# Altium project isolated TTL_to_485.PrjPcb
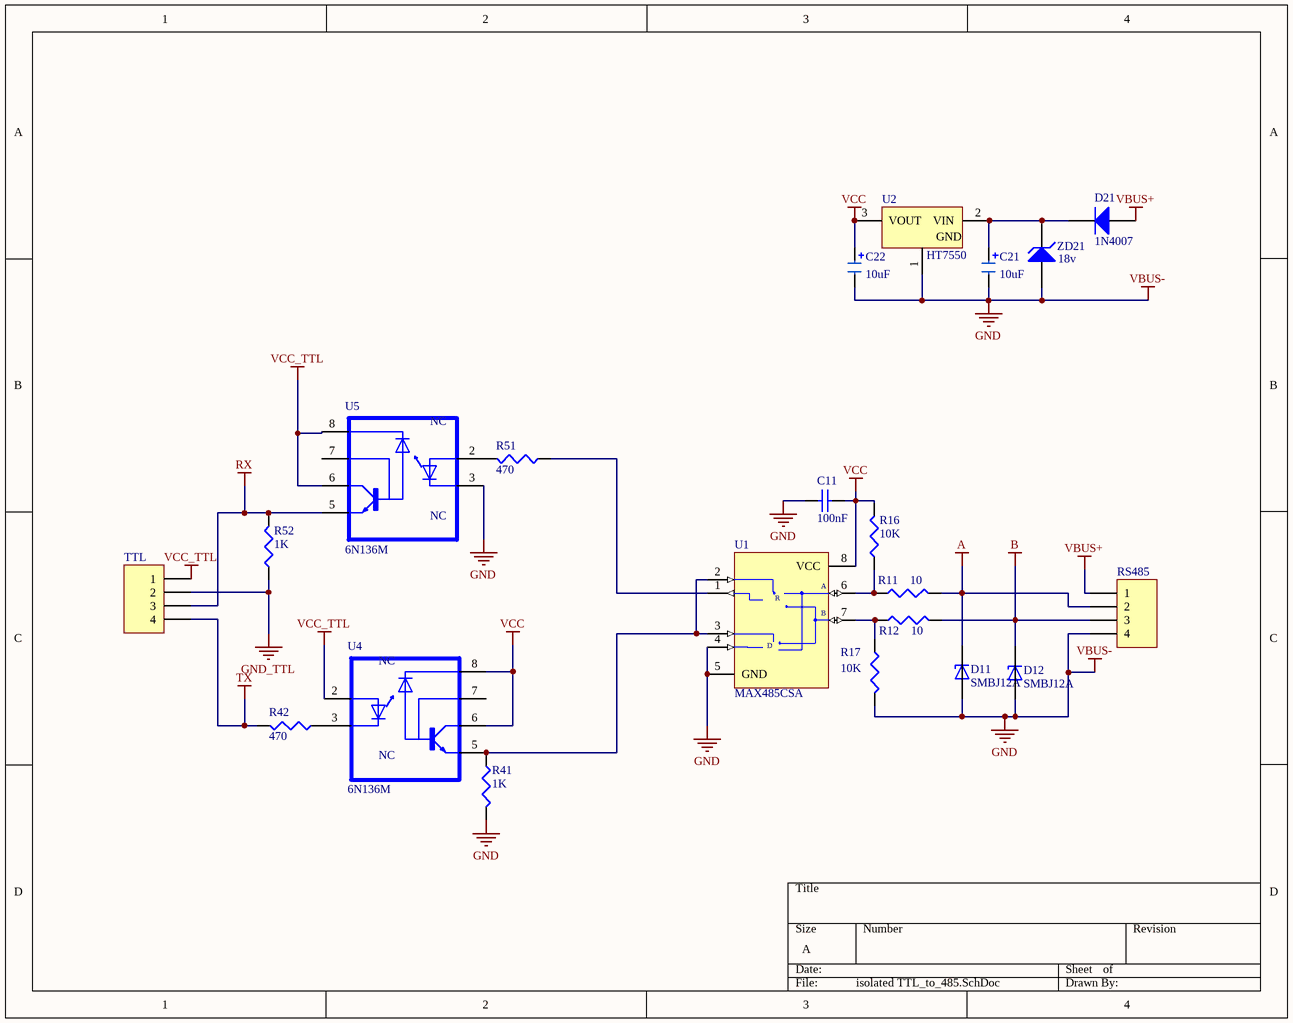
[diagram p0: isolated TTL_to_485.SchDoc]
1 sheet, 21 parts. Net scope: global (net labels, ports and power ports of the same name join across sheets).
Board file: isolated TTL_to_485.PcbDoc

## Sheet isolated TTL_to_485.SchDoc
size A

### Parts
C11  value 100nF  [C1206]  (hidden comment: Cap)
C21  value 10uF  [Tantalium CASE B]  (hidden comment: 106E)
C22  value 10uF  [Tantalium CASE B]  (hidden comment: 106C)
D11  SMBJ12A  [DIOM4336X265N]
D12  SMBJ12A  [DIOM4336X265N]
D21  1N4007  [SMA]
R11  value 10  [1206 Resistor]  (hidden comment: Res)
R12  value 10  [1206 Resistor]  (hidden comment: Res)
R16  value 10K  [1206 Resistor]  (hidden comment: Res)
R17  value 10K  [1206 Resistor]  (hidden comment: Res)
R41  value 1K  [1206 Resistor]  (hidden comment: Res)
R42  value 470  [1206 Resistor]  (hidden comment: Res)
R51  value 470  [1206 Resistor]  (hidden comment: Res)
R52  value 1K  [1206 Resistor]  (hidden comment: Res)
RS485  Header 4  [HDR1X4]  (value not drawn)
TTL  Header 4  [HDR1X4]  (value not drawn)
U1  MAX485CSA  [NSO8_N]
U2  HT7550  [SOT-89_M]
U4  6N136M  [DIP762W50P254L977H451Q8]
U5  6N136M  [DIP762W50P254L977H451Q8]
ZD21  value 18v  [Mini MELF]  (hidden comment: Diode Zener)

### Nets
A: D11.C R11.2 RS485.2
B: D12.C R12.2 RS485.3
GND: C11.2 C21.2 C22.2 D11.A D12.A R17.2 R41.2 RS485.4 U1.4(DI) U1.5(GND) U2.1(GND) U5.3(C) ZD21.1(A)  [also labelled VBUS-]
GND_TTL: R52.1 TTL.2
RX: R52.2 TTL.3 U5.5(E/GND)
TX: R42.2 TTL.4
VBUS+: D21.1(A) RS485.1
VCC: C11.1 C22.1 R16.2 U1.8(VCC) U2.3(VOUT) U4.6(C/VO) U4.8(C/VCC)
VCC_TTL: TTL.1 U4.2(A) U5.6(C/VO) U5.8(C/VCC)
NetC21_1: C21.1 D21.2(K) U2.2(VIN) ZD21.2(K)
NetR11_1: R11.1 R16.1 U1.6(A)
NetR12_1: R12.1 R17.1 U1.7(B)
NetR41_1: R41.1 U1.2(~{RE}) U1.3(DE) U4.5(E/GND)
NetR42_1: R42.1 U4.3(C)
NetR51_1: R51.1 U1.1(RO)
NetR51_2: R51.2 U5.2(A)

Not connected (* = marked no-connect by the designer): U4 7(B/VB); U5 7(B/VB)

### Notes on the sheet
- (in symbol 6N136M) NC
- (in symbol MAX485CSA) R; D

### Library data of the parts
C11 = Cap: Capacitor
C21 C22 = Cap Pol2: Polarized Capacitor Tantalium
D11 D12 = SMBJ12A: 15.6V Clamp 17.5A Ipp Tvs Diode Surface Mount DO-214AA (SMB); MF: ON Semiconductor; Purchase-URL: https://pricing.snapeda.com/search/part/SMBJ12A/?ref=eda; MP: SMBJ12A; SnapEDA_Link: https://www.snapeda.com/parts/SMBJ12A/Onsemi/view-part/?ref=snap; Price: None; Package: SMB-2 Fairchild Semiconductor; Check_prices: https://www.snapeda.com/parts/SMBJ12A/Onsemi/view-part/?ref=eda; Value: *; Availability: In Stock
D21 = Diode: Default Diode; Published: 8-Jun-2000; LatestRevisionDate: 17-Jul-2002; LatestRevisionNote: Re-released for DXP Platform.; PackageVersion: Sep-1996; PackageReference: SMC; Publisher: Altium Limited; PackageDescription: DO-214-AB/SMC; 2 C-Bend Leads; Body 7.9 x 5.9 mm, inc. leads (LxW); Code_JEDEC: DO-214-AB
R11 R12 R16 R17 R41 R42 R51 R52 = Res: Resistor; PackageDescription: Chip Resistor
RS485 TTL = Header 4: Header, 4-Pin; LatestRevisionDate: 17-Jul-2002; LatestRevisionNote: Re-released for DXP Platform.; Publisher: Altium Limited
U1 = MAX485CSA: Low-Power, Slew-Rate-Limited RS-485/RS-422 Transceiver; Published: 16-Jan-2001; LatestRevisionDate: 13-Apr-2006; LatestRevisionNote: IPC-7351 Footprint Added.; DatasheetVersion: Feb-1996; PackageReference: NSO8; Publisher: Altium Limited; PackageDescription: 8-Pin Small Outline Integrated Circuit 1.27 mm Pitch; Code_JEDEC: MS-012-AA; Code_IPC: SOIC127P600-8; ComponentLink1Description: Manufacturer Link; ComponentLink1URL: http://www.maxim-ic.com/; ComponentLink2Description: Datasheet; ComponentLink2URL: http://pdfserv.maxim-ic.com/en/ds/MAX1487-MAX491.pdf
U2 = L78L33ABUTR: Positive Voltage Regulator, 3.3V, 4-Pin SOT-89, Tape and Reel; DatasheetVersion: Feb-2011; PackageVersion: 2011; PackageReference: SOT-89; PackageDescription: 3-Pin SOT-89 Package 1.5 mm Pitch, 4.1 mm Lead Span; PartNumber: L78L33ABUTR; ComponentLink1Description: Manufacturer URL; ComponentLink1URL: http://www.st.com; ComponentLink2Description: Datasheet; ComponentLink2URL: http://www.st.com/internet/com/TECHNICAL_RESOURCES/TECHNICAL_LITERATURE/DATASHEET/CD00000446.pdf
U4 U5 = 6N136M: High Speed Optocoupler, 1 MBd, Photodiode with Transistor Output; Package: None; Price: None; Value: *; MP: 6N136M; Availability: Unavailable
ZD21 = Diode Zener: Zener Diode; PackageDescription: Zener Diode